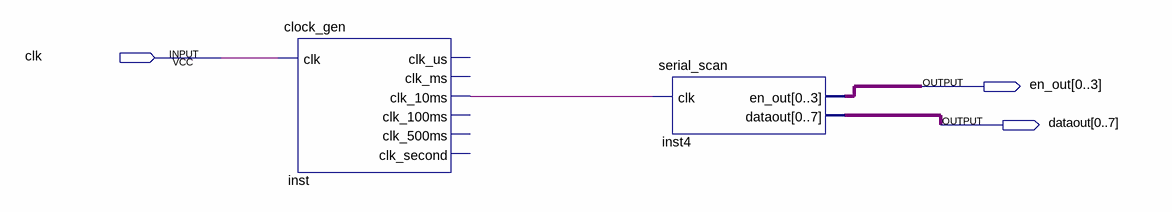
[diagram p0: schematic sheet]
// Quartus schematic task4_serial_scan.bdf as structural Verilog: 2 symbols, 3 pins
module task4_serial_scan (
  input  clk,
  output [0:3] en_out,
  output [0:7] dataout
);

  wire inst_clk_10ms;

  clock_gen inst (.clk(clk), .clk_10ms(inst_clk_10ms));  // open: clk_us, clk_ms, clk_100ms, clk_500ms, clk_second
  serial_scan inst4 (.clk(inst_clk_10ms), .en_out(en_out), .dataout(dataout));
endmodule
